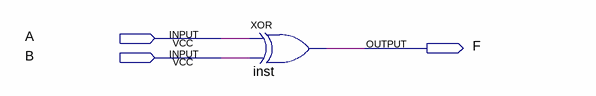
[diagram p0: schematic sheet]
// Quartus schematic xorGate.bdf as structural Verilog: 1 symbols, 3 pins
module xorGate (
  input  A,
  input  B,
  output F
);

  xor inst (F, A, B);
endmodule
